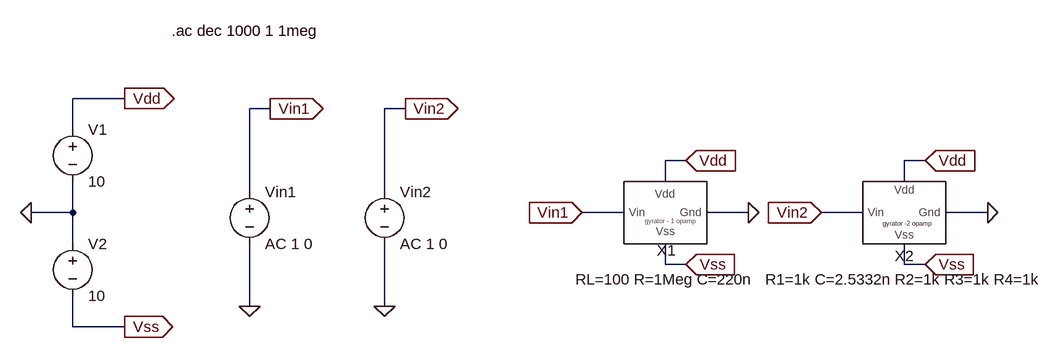
[diagram p0: schematic gyrators frequency response.asc]
gyrators frequency response.asc, the LTspice schematic file:
Version 4
SHEET 1 880 680
WIRE -736 -48 -816 -48
WIRE -512 -32 -544 -32
WIRE -304 -32 -336 -32
WIRE -816 0 -816 -48
WIRE 128 48 96 48
WIRE 496 48 464 48
WIRE 96 80 96 48
WIRE 464 80 464 48
WIRE -544 96 -544 -32
WIRE -336 96 -336 -32
WIRE -816 128 -816 80
WIRE -816 128 -880 128
WIRE 32 128 -32 128
WIRE 224 128 160 128
WIRE 400 128 336 128
WIRE 592 128 528 128
WIRE -816 176 -816 128
WIRE 96 208 96 176
WIRE 128 208 96 208
WIRE 464 208 464 176
WIRE 496 208 464 208
WIRE -544 272 -544 176
WIRE -336 272 -336 176
WIRE -816 304 -816 256
WIRE -736 304 -816 304
FLAG -544 272 0
FLAG -512 -32 Vin1
IOPIN -512 -32 Out
FLAG -880 128 0
FLAG -736 -48 Vdd
IOPIN -736 -48 Out
FLAG -736 304 Vss
IOPIN -736 304 Out
FLAG -336 272 0
FLAG -304 -32 Vin2
IOPIN -304 -32 Out
FLAG -32 128 Vin1
IOPIN -32 128 In
FLAG 336 128 Vin2
IOPIN 336 128 In
FLAG 224 128 0
FLAG 592 128 0
FLAG 128 48 Vdd
IOPIN 128 48 In
FLAG 496 48 Vdd
IOPIN 496 48 In
FLAG 128 208 Vss
IOPIN 128 208 In
FLAG 496 208 Vss
IOPIN 496 208 In
SYMBOL Gyr1 96 144 R0
WINDOW 39 0 102 Bottom 2
SYMATTR InstName X1
SYMATTR SpiceLine RL=100 R=1Meg C=220n
SYMBOL Gyr2 464 112 R0
WINDOW 39 0 134 Bottom 2
SYMATTR InstName X2
SYMATTR SpiceLine R1=1k C=2.5332n R2=1k R3=1k R4=1k
SYMBOL voltage -544 80 R0
WINDOW 123 0 0 Left 0
WINDOW 39 0 0 Left 0
SYMATTR InstName Vin1
SYMATTR Value AC 1 0
SYMBOL voltage -816 -16 R0
WINDOW 123 0 0 Left 0
WINDOW 39 0 0 Left 0
SYMATTR InstName V1
SYMATTR Value 10
SYMBOL voltage -816 160 R0
WINDOW 123 0 0 Left 0
WINDOW 39 0 0 Left 0
SYMATTR InstName V2
SYMATTR Value 10
SYMBOL voltage -336 80 R0
WINDOW 123 0 0 Left 0
WINDOW 39 0 0 Left 0
SYMATTR InstName Vin2
SYMATTR Value AC 1 0
TEXT -664 -152 Left 2 !.ac dec 1000 1 1meg

The netlist it stands for:
* gyrators frequency response.asc
XX1 Vdd Vss 0 Vin1 G1 RL=100 R=1Meg C=220n  ; pins Vdd Vss Gnd Vin
XX2 0 Vdd Vss Vin2 Gyr2 R1=1k C=2.5332n R2=1k R3=1k R4=1k  ; pins Gnd Vdd Vss Vin
Vin1 Vin1 0 AC 1 0
V1 Vdd 0 10
V2 0 Vss 10
Vin2 Vin2 0 AC 1 0
.ac dec 1000 1 1meg
.backanno
.end